# EAGLE design TREM_STM_MOTHERBBOARD (EAGLE 9.2.2)
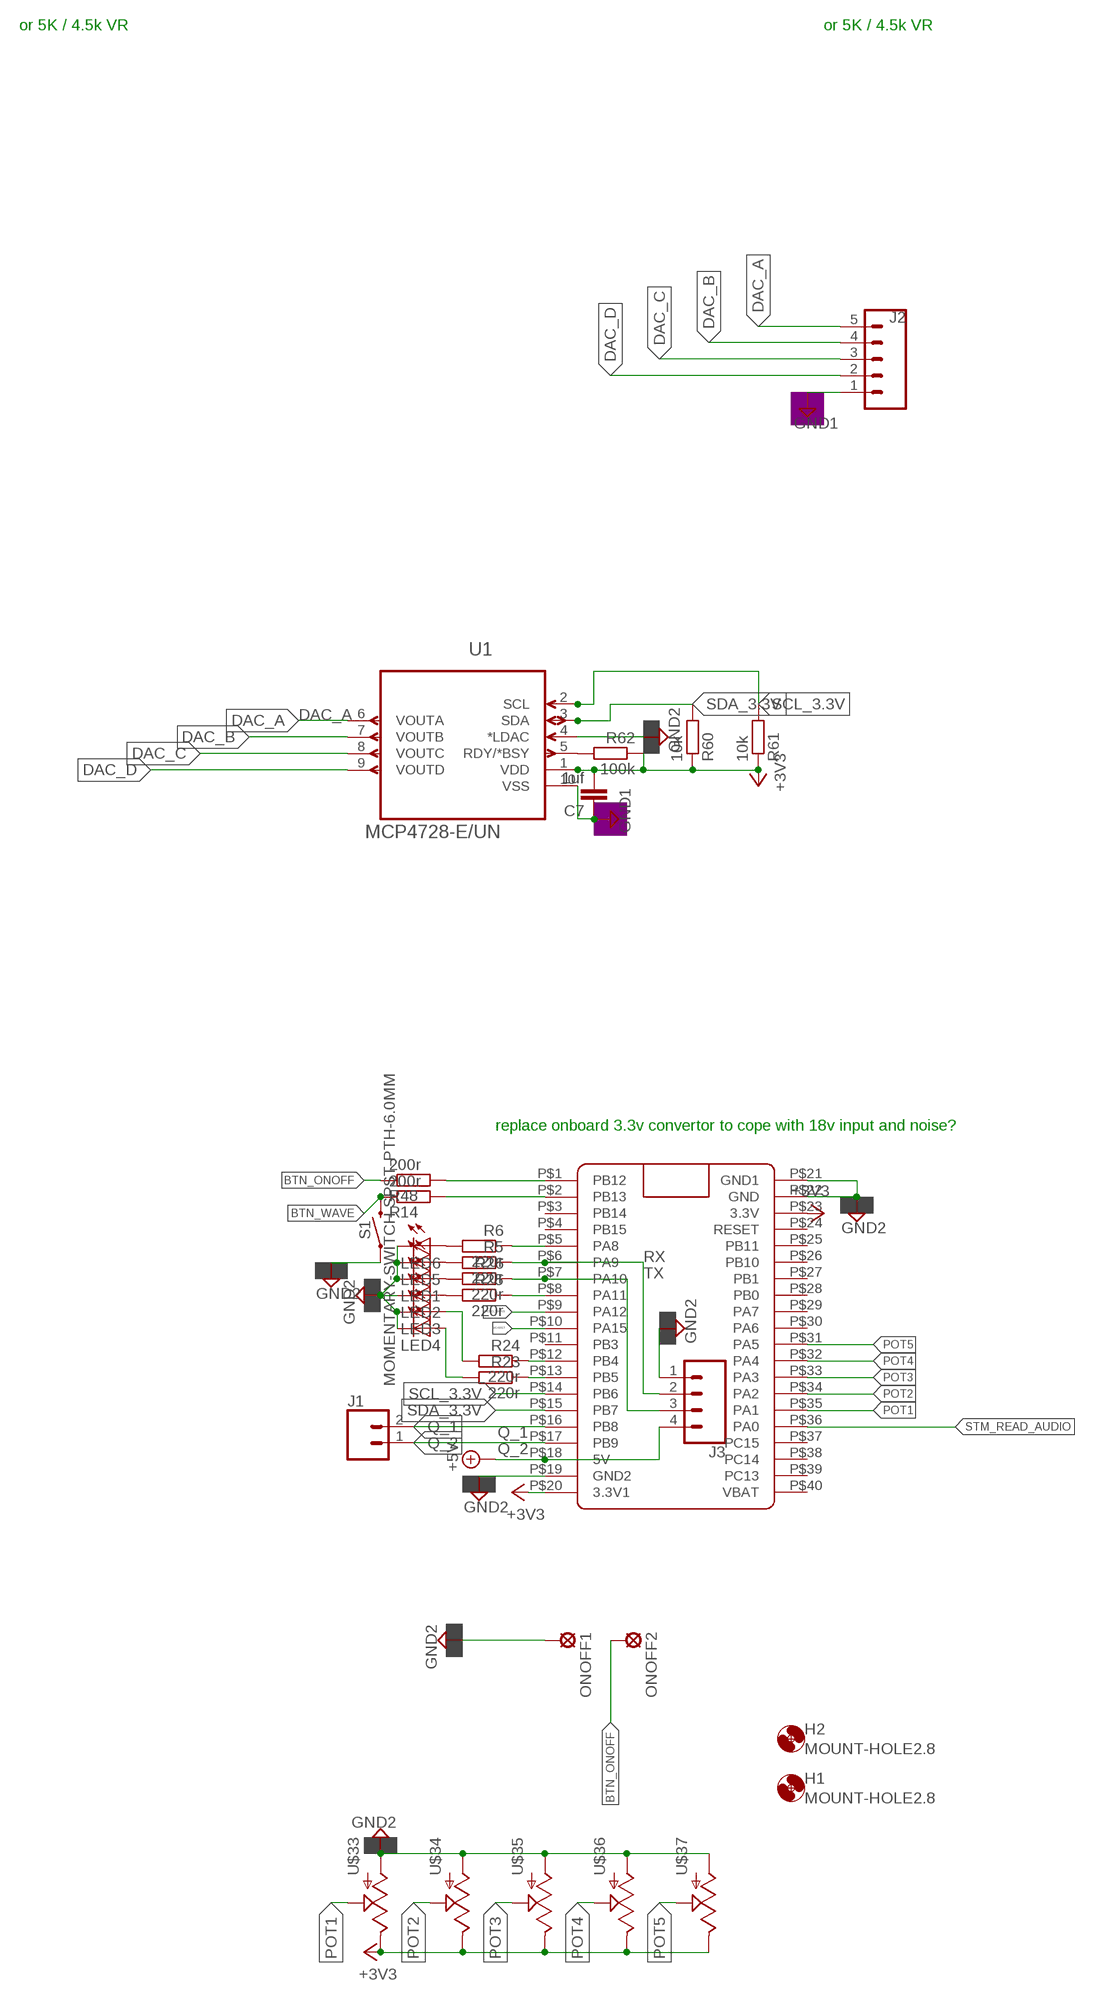
[diagram p0: schematic, sheet 1, part 1 of 2]
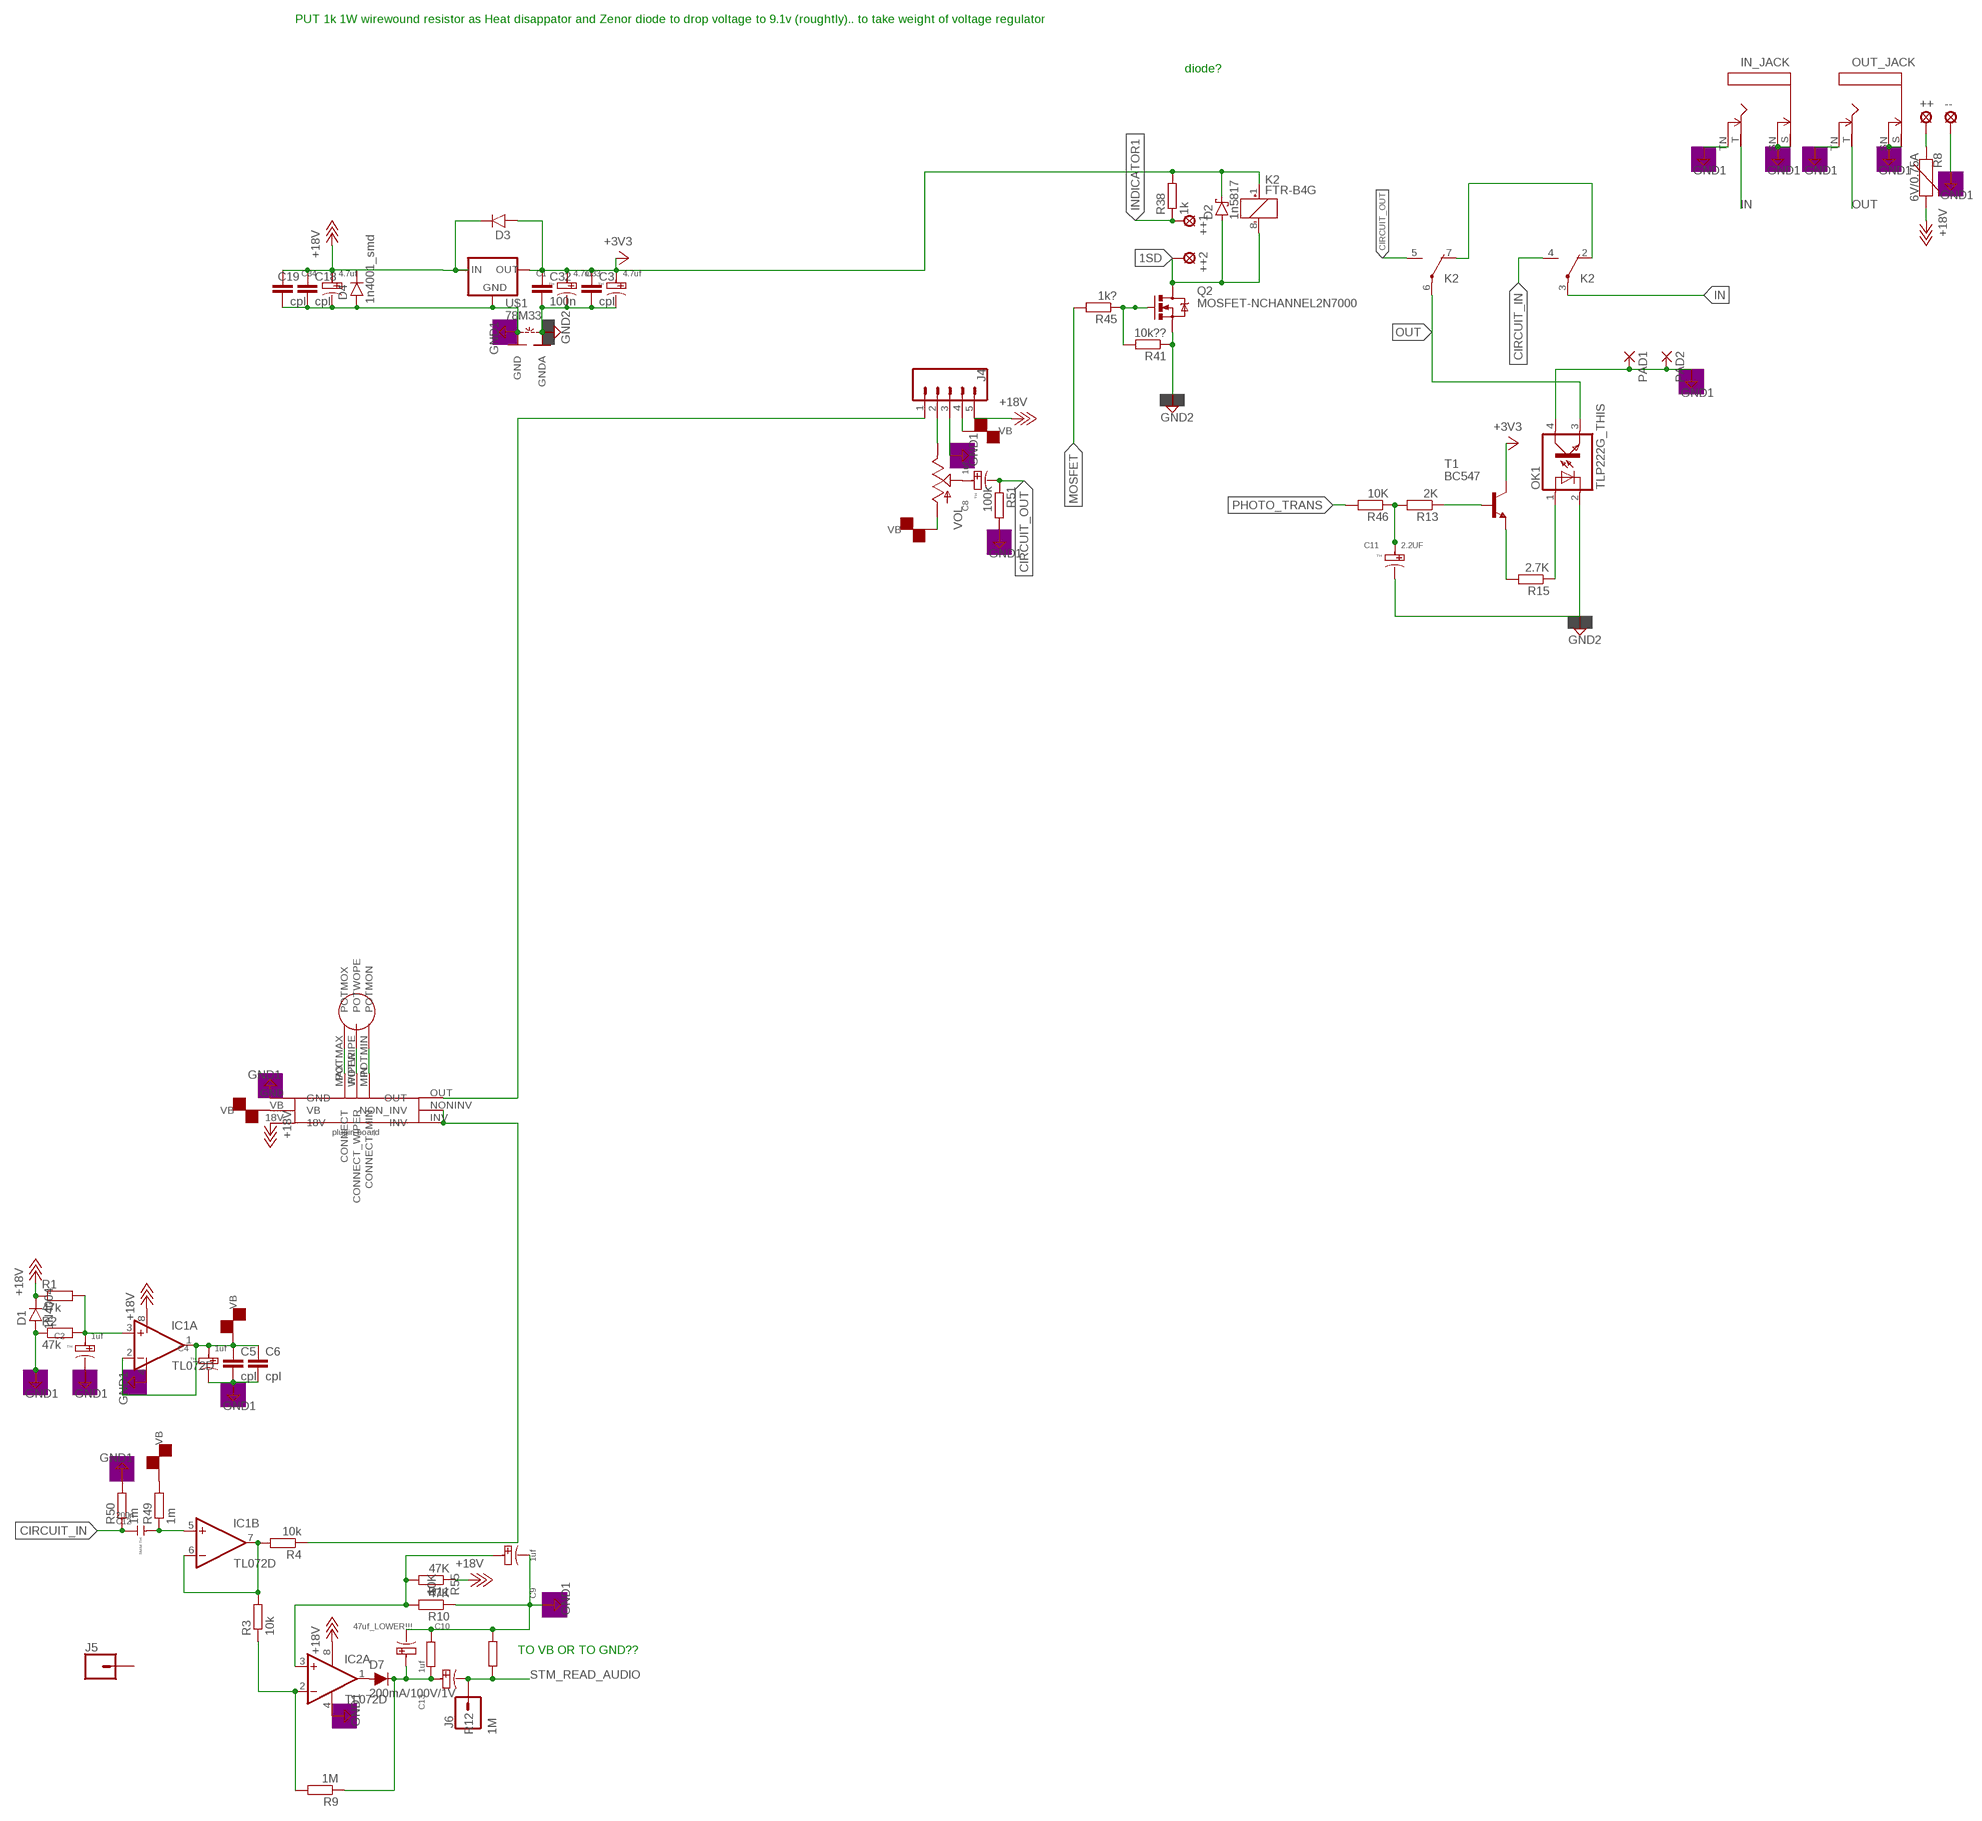
[diagram p1: schematic, sheet 1, part 2 of 2]

## Parts
++  LSP10  [LSP10]
++1  LSP10  [LSP10]
++2  LSP10  [LSP10]
--  LSP10  [LSP10]
C1  4.7uf  THRU-HOLE-POLARIZED  [PC-D5.3MM]
C2  1uf  THRU-HOLE-POLARIZED  [PC-D5.3MM]
C3  cpl  C-EUC1206  [C1206]
C4  1uf  THRU-HOLE-POLARIZED  [PC-D5.3MM]
C5  cpl  C-EUC1206  [C1206]
C6  cpl  C-EUC1206  [C1206]
C7  1uf  C-EUC1206  [C1206]
C8  1uf  THRU-HOLE-POLARIZED  [PC-D5.3MM]
C9  1uf  THRU-HOLE-POLARIZED  [PC-D5.3MM]
C10  47uf_LOWER!!!  THRU-HOLE-POLARIZED  [PC-D5.3MM]
C11  2.2UF  THRU-HOLE-POLARIZED  [PC-D5.3MM]
C12  200n  THRU_HOLE_5MM_SPACING  [CERAMIC-5MM]
C13  1uf  THRU-HOLE-POLARIZED  [PC-D5.3MM]
C18  cpl  C-EUC1206  [C1206]
C19  cpl  C-EUC1206  [C1206]
C32  100n  C-EUC1206  [C1206]
C33  4.7uf  THRU-HOLE-POLARIZED  [PC-D5.3MM]
C34  4.7uf  THRU-HOLE-POLARIZED  [PC-D5.3MM]
D1  1N4004  1N400X.1  [DO41-1]
D2  1n5817  SCHOTTKY-DIODESMD  [SMB]
D3  1n4001_smd  1N400X.1  [DO41-1]
D4  1n4001_smd  1N400X.1  [DO41-1]
D7  200mA/100V/1V  DIODE-1N4148  [DIODE-1N4148]
H1  MOUNT-HOLE2.8  [2,8]
H2  MOUNT-HOLE2.8  [2,8]
IC1  TL072D  [SO08]
IC2  TL072D  [SO08]
IN_JACK  MMMONNNNOHOLES  [MONONOHOLES]
J1  CONN_02PTH3  [1X02_LONGPADS]
J2  CONN_05PTH_LONGPADS  [1X05_LONGPADS]
J3  CONN_04LONGPADS  [1X04_LONGPADS]
J4  CONN_05PTH_LONGPADS  [1X05_LONGPADS]
J5  CONN_01  [1X01]
J6  CONN_01  [1X01]
K2  FTR-B4G  [FTR-B4G]
LED1  LED3MM  [LED3MM]
LED2  LED3MM  [LED3MM]
LED3  LED3MM  [LED3MM]
LED4  LED3MM  [LED3MM]
LED5  LED3MM  [LED3MM]
LED6  LED3MM  [LED3MM]
OK1  TLP222G_THIS  [DIL04]
ONOFF1  LSP10  [LSP10]
ONOFF2  LSP10  [LSP10]
OUT_JACK  MMMONNNNOHOLES  [MONONOHOLES]
PAD1  SMD2  [SMD1,27-2,54]
PAD2  SMD2  [SMD1,27-2,54]
Q2  MOSFET-NCHANNEL2N7000  [TO-92]
R1  47k  R-EU_M1206  [M1206]
R2  47k  R-EU_M1206  [M1206]
R3  10k  R-EU_M1206  [M1206]
R4  10k  R-EU_M1206  [M1206]
R5  220r  R-EU_M1206  [M1206]
R6  220r  R-EU_M1206  [M1206]
R8  6V/0.75A  PPTC_THREE-QUARTER-AMP  [1206]
R9  1M  R-EU_M1206  [M1206]
R10  47K  R-EU_M1206  [M1206]
R11  47K  R-EU_M1206  [M1206]
R12  1M  R-EU_M1206  [M1206]
R13  2K  R-EU_M1206  [M1206]
R14  200r  R-EU_M1206  [M1206]
R15  2.7K  R-EU_M1206  [M1206]
R23  220r  R-EU_M1206  [M1206]
R24  220r  R-EU_M1206  [M1206]
R25  220r  R-EU_M1206  [M1206]
R26  220r  R-EU_M1206  [M1206]
R38  1k  R-EU_M1206  [M1206]
R41  10k??  R-EU_M1206  [M1206]
R45  1k?  R-EU_M1206  [M1206]
R46  10K  R-EU_M1206  [M1206]
R48  200r  R-EU_M1206  [M1206]
R49  1m  R-EU_M1206  [M1206]
R50  1m  R-EU_M1206  [M1206]
R51  100k  R-EU_M1206  [M1206]
R55  10K  R-EU_M1206  [M1206]
R60  10k  R-EU_M1206  [M1206]
R61  10k  R-EU_M1206  [M1206]
R62  100k  R-EU_M1206  [M1206]
S1  MOMENTARY-SWITCH-SPST-PTH-6.0MM  [TACTILE_SWITCH_PTH_6.0MM]
T1  BC547  [TO92]
U1  MCP4728-E/UN  [SOP50P490X110-10N]
U$1  78M33  [SOT223]
U$4  GT_PLUGIN  [PLUGIN_RECIEVE]
U$11  BLUE_PILL  [BLUE_PILL]
U$33  POT  [ALPS_POT]
U$34  POT  [ALPS_POT]
U$35  POT  [ALPS_POT]
U$36  POT  [ALPS_POT]
U$37  POT  [ALPS_POT]
VOL  POT  [ALPS_POT]
~NUDEV~1  GND-GNDA1,27MM  [GND-GNDA-1,27MM]

## Nets
1SD: ++2.MP D2.A K2.8(K:-) Q2.3(D)
+3V3: C1.+ C3.1 C7.2 C32.1 C33.+ D2.C D3.A K2.1(K:+) R38.2 R60.1 R61.1 R62.1 T1.3(C) U1.1(VDD) U$1.3(OUT) U$11.P$20(3.3V1) U$11.P$23(3.3V) U$33.P$1(E) U$34.P$1(E) U$35.P$1(E) U$36.P$1(E) U$37.P$1(E)
+5V: J3.4 U$11.P$18(5V)
+18V: D1.C IC1.8(P:V+) IC2.8(P:V+) J4.5 R1.1 R8.2 R11.1 U$4.18V
BTN_ONOFF: ONOFF2.MP R48.1
BTN_WAVE: R14.1 S1.3
CIRCUIT_IN: C12.1 K2.4(-1:S) R50.1
CIRCUIT_OUT: C8.- K2.5(-2:S) R51.1
DAC_A: J2.5 U1.6(VOUTA)
DAC_B: J2.4 U1.7(VOUTB)
DAC_C: J2.3 U1.8(VOUTC)
DAC_D: J2.2 U1.9(VOUTD)
GND1: --.MP C2.- C4.- C5.2 C6.2 C7.1 C9.- C10.- C18.2 C19.2 C34.- D1.A D4.A IC1.4(P:V-) IC2.4(P:V-) IN_JACK.S IN_JACK.SN IN_JACK.TN J2.1 J4.3 OK1.4(COL) OUT_JACK.S OUT_JACK.SN OUT_JACK.TN PAD1.1(P) PAD2.1(P) R2.1 R10.1 R12.2 R50.2 R51.2 R55.1 U1.10(VSS) U$1.2(GND) U$1.4(GND) U$4.GND ~NUDEV~1.GND
GND2: C1.- C3.2 C11.- C32.2 C33.- J3.1 LED1.K(C) LED2.K(C) LED3.K(C) LED4.K(C) LED5.K(C) LED6.K(C) OK1.2(C) ONOFF1.MP Q2.1(S) R41.1 S1.1 U1.4(*LDAC) U$11.P$19(GND2) U$11.P$21(GND1) U$11.P$22(GND) U$33.P$3(A) U$34.P$3(A) U$35.P$3(A) U$36.P$3(A) U$37.P$3(A) ~NUDEV~1.GNDA
IN: IN_JACK.T K2.3(-1:P)
INDICATOR1: ++1.MP R38.1
MOSFET: R45.2 U$11.P$10(PA15)
N$1: J4.1 U$4.OUT
N$2: C2.+ IC1.3(A:+IN) R1.2 R2.2
N$3: U$4.MAX(CONNECT) U$4.POTMAX(POTMOX)
N$4: U$4.POTWIPE(POTWOPE) U$4.WIPER(CONNECT_WIPER)
N$5: U$4.MIN(CONNECT_MIN) U$4.POTMIN(POTMON)
N$6: R4.1 U$4.INV U$4.NONINV(NON_INV)
N$7: R23.1 U$11.P$13(PB5)
N$8: R24.1 U$11.P$12(PB4)
N$9: C9.+ IC2.3(A:+IN) R10.2 R11.2
N$10: C8.+ VOL.P$2(S)
N$11: C18.1 C19.1 C34.+ D3.C D4.C U$1.1(IN) ; supply symbol labelled +18V
N$12: R62.2 U1.5(RDY/*BSY)
N$13: C10.+ C13.+ D7.C R9.1 R55.2
N$14: IC2.2(A:-IN) R3.1 R9.2
N$15: C11.+ R13.2 R46.1
N$16: IC1.6(B:-IN) IC1.7(B:OUT) R3.2 R4.2
N$17: D7.A IC2.1(A:OUT)
N$18: R15.2 T1.1(E)
N$19: R25.1 U$11.P$8(PA11)
N$20: OK1.1(A) R15.1
N$21: R13.1 T1.2(B)
N$31: LED1.A R26.2
N$36: LED2.A R25.2
N$37: K2.2(-1:O) K2.7(-2:O)
N$38: LED3.A R24.2
N$39: LED4.A R23.2
N$40: J4.2 VOL.P$1(E)
N$41: ++.MP R8.1
N$43: C12.2 IC1.5(B:+IN) R49.1
N$47: R48.2 U$11.P$1(PB12)
N$48: R14.2 U$11.P$2(PB13)
N$50: R6.1 U$11.P$5(PA8)
N$51: LED5.A R5.2
N$52: LED6.A R6.2
N$84: Q2.2(G) R41.2 R45.1
OUT: K2.6(-2:P) OK1.3(EMIT) OUT_JACK.T
PHOTO_TRANS: R46.2 U$11.P$9(PA12)
POT1: U$11.P$35(PA1) U$33.P$2(S)
POT2: U$11.P$34(PA2) U$34.P$2(S)
POT3: U$11.P$33(PA3) U$35.P$2(S)
POT4: U$11.P$32(PA4) U$36.P$2(S)
POT5: U$11.P$31(PA5) U$37.P$2(S)
Q_1: J1.2 U$11.P$16(PB8)
Q_2: J1.1 U$11.P$17(PB9)
RX: J3.2 R5.1 U$11.P$6(PA9)
SCL_3.3V: R61.2 U1.2(SCL) U$11.P$14(PB6)
SDA_3.3V: R60.2 U1.3(SDA) U$11.P$15(PB7)
STM_READ_AUDIO: C13.- J6.1 R12.1 U$11.P$36(PA0)
TX: J3.3 R26.1 U$11.P$7(PA10)
VB: C4.+ C5.1 C6.1 IC1.1(A:OUT) IC1.2(A:-IN) J4.4 R49.2 U$4.VB VOL.P$3(A)
Unconnected: IC2.5(B:+IN) IC2.6(B:-IN) IC2.7(B:OUT) J5.1 U$11.P$3(PB14) U$11.P$4(PB15) U$11.P$11(PB3) U$11.P$24(RESET) U$11.P$25(PB11) U$11.P$26(PB10) U$11.P$27(PB1) U$11.P$28(PB0) U$11.P$29(PA7) U$11.P$30(PA6) U$11.P$37(PC15) U$11.P$38(PC14) U$11.P$39(PC13) U$11.P$40(VBAT)

## Notes on the sheet
- or 5K / 4.5k VR | or 5K / 4.5k VR
- PUT 1k 1W wirewound resistor as Heat disappator and Zenor diode to drop voltage to 9.1v (roughtly).. to take weight of voltage regulator
- diode?
- replace onboard 3.3v convertor to cope with 18v input and noise?
- TO VB OR TO GND??

## Library data of the parts
++ ++1 ++2 -- ONOFF1 ONOFF2 = solpad:LSP10: SOLDER PAD drill 1.0 mm, distributor Buerklin, 12H555
C1 C2 C4 C8-C11 C13 C33 C34 = GT_Capacitor:THRU-HOLE-POLARIZED: 302030033; PACKAGE: TH
C3 C5-C7 C18 C19 C32 = resistor:C-EU: CAPACITOR, European symbol
C12 = GT_Capacitor:THRU_HOLE_5MM_SPACING: 302010202; PACKAGE: 5MM TH
D1 D3 D4 = gm-diodes:1N400X: Rectifier Diodes often used in power supply to prevent damage from reverse polarization
D2 = diode:SCHOTTKY-DIODE: Schottky Diode
D7 = SparkFun-DiscreteSemi:DIODE: Diode These are standard reverse protection diodes and small signal diodes. SparkFun Products: SparkFun SparkPunk Sound Kit <https://www.sparkfun.com/products/11177> SparkFun ESP8266 Thing <https://www.sparkfun.com/products/13231>; PROD_ID: DIO-08378
H1 H2 = holes:MOUNT-HOLE: MOUNTING HOLE with drill center marker
IC1 IC2 = linear:TL072: OP AMP
IN_JACK OUT_JACK = gm-jacks2:MMMONNN
J1 = GT_Connectors:CONN_02: Multi connection point. Often used as Generic Header-pin footprint for 0.1 inch spaced/style header connections On any of the 0.1 inch spaced packages, you can populate with these: Break Away Headers - Straight <https://www.sparkfun.com/products/116> (PRT-00116) Break Away Male Headers - Right Angle <https://www.sparkfun.com/products/553> (PRT-00553) Female Headers <https://www.sparkfun.com/products/115> (PRT-00115) Break Away Headers - Machine Pin <https://www.sparkfun.com/products/117> (PRT-00117) Break Away Female Headers - Swiss Machine Pin <https://www.sparkfun.com/products/743> (PRT-00743) For SCREWTERMINALS and SPRING TERMINALS visit here: Screw Terimnals on SparkFun.com <https://www.sparkfun.com/search/results?term=Screw+Terminals> (5mm/3.5mm/2.54mm spacing) This device is also useful as a general connection point to wire up your design to another part of your project. Our various solder wires solder well into these plated through hole pads. Hook-Up Wire - Assortment (Stranded, 22 AWG) <https://www.sparkfun.com/products/11375> (PRT-11375) Hook-Up Wire - Assortment (Solid Core, 22 AWG) <https://www.sparkfun.com/products/11367> (PRT-11367) View the entire wire category on our website here <https://www.sparkfun.com/categories/141> Special notes: Molex polarized connector foot print use with: PRT-08233 with associated crimp pins and housings. 2.54_SCREWTERM for use with PRT-10571. 3.5mm Screw Terminal footprints for PRT-08084 5mm Screw Terminal footprints for use with PRT-08432
J2 J4 = GT_Connectors:CONN_05: Multi connection point. Often used as Generic Header-pin footprint for 0.1 inch spaced/style header connections On any of the 0.1 inch spaced packages, you can populate with these: Break Away Headers - Straight <https://www.sparkfun.com/products/116> (PRT-00116) Break Away Male Headers - Right Angle <https://www.sparkfun.com/products/553> (PRT-00553) Female Headers <https://www.sparkfun.com/products/115> (PRT-00115) Break Away Headers - Machine Pin <https://www.sparkfun.com/products/117> (PRT-00117) Break Away Female Headers - Swiss Machine Pin <https://www.sparkfun.com/products/743> (PRT-00743) For SCREWTERMINALS and SPRING TERMINALS visit here: Screw Terimnals on SparkFun.com <https://www.sparkfun.com/search/results?term=Screw+Terminals> (5mm/3.5mm/2.54mm spacing) This device is also useful as a general connection point to wire up your design to another part of your project. Our various solder wires solder well into these plated through hole pads. Hook-Up Wire - Assortment (Stranded, 22 AWG) <https://www.sparkfun.com/products/11375> (PRT-11375) Hook-Up Wire - Assortment (Solid Core, 22 AWG) <https://www.sparkfun.com/products/11367> (PRT-11367) View the entire wire category on our website here <https://www.sparkfun.com/categories/141> Special notes: Molex polarized connector foot print use with SKU : PRT-08231 with associated crimp pins and housings. 1MM SMD Version SKU: PRT-10208
J3 = GT_Connectors:CONN_04: Multi connection point. Often used as Generic Header-pin footprint for 0.1 inch spaced/style header connections On any of the 0.1 inch spaced packages, you can populate with these: Break Away Headers - Straight <https://www.sparkfun.com/products/116> (PRT-00116) Break Away Male Headers - Right Angle <https://www.sparkfun.com/products/553> (PRT-00553) Female Headers <https://www.sparkfun.com/products/115> (PRT-00115) Break Away Headers - Machine Pin <https://www.sparkfun.com/products/117> (PRT-00117) Break Away Female Headers - Swiss Machine Pin <https://www.sparkfun.com/products/743> (PRT-00743) For SCREWTERMINALS and SPRING TERMINALS visit here: Screw Terimnals on SparkFun.com <https://www.sparkfun.com/search/results?term=Screw+Terminals> (5mm/3.5mm/2.54mm spacing) This device is also useful as a general connection point to wire up your design to another part of your project. Our various solder wires solder well into these plated through hole pads. Hook-Up Wire - Assortment (Stranded, 22 AWG) <https://www.sparkfun.com/products/11375> (PRT-11375) Hook-Up Wire - Assortment (Solid Core, 22 AWG) <https://www.sparkfun.com/products/11367> (PRT-11367) View the entire wire category on our website here <https://www.sparkfun.com/categories/141> Special notes: Molex polarized connector foot print use with SKU : PRT-08231 with associated crimp pins and housings. 1MM SMD Version SKU: PRT-10208; PROD_ID: CONN-09696
J5 J6 = GT_Connectors:CONN_01: Single connection point. Often used as Generic Header-pin footprint for 0.1 inch spaced/style header connections On any of the 0.1 inch spaced packages, you can populate with these: Break Away Headers - Straight <https://www.sparkfun.com/products/116> (PRT-00116) Break Away Male Headers - Right Angle <https://www.sparkfun.com/products/553> (PRT-00553) Female Headers <https://www.sparkfun.com/products/115> (PRT-00115) Break Away Headers - Machine Pin <https://www.sparkfun.com/products/117> (PRT-00117) Break Away Female Headers - Swiss Machine Pin <https://www.sparkfun.com/products/743> (PRT-00743) This device is also useful as a general connection point to wire up your design to another part of your project. Our various solder wires solder well into these plated through hole pads. Hook-Up Wire - Assortment (Stranded, 22 AWG) <https://www.sparkfun.com/products/11375> (PRT-11375) Hook-Up Wire - Assortment (Solid Core, 22 AWG) <https://www.sparkfun.com/products/11367> (PRT-11367) View the entire wire category on our website here <https://www.sparkfun.com/categories/141> Special notes: SMTSO-256-ET is a "flush mount" nut for a 4-40 screw. We mostly use this on specialty testbeds; it is a nice way to connect hardware to your PCB at an adjustable hieght. Also note, the SNAP packages are for using a snappable style connector. We sell a baggie of snaps and they are also used on two LilyPad designs: Snap Assortment - 30 pack (male and female) <https://www.sparkfun.com/products/11347> (DEV-11347) LilyPad Arduino SimpleSnap <https://www.sparkfun.com/products/10941> (DEV-10941) LilyPad SimpleSnap Protoboard <https://www.sparkfun.com/products/10940> (DEV-10940)
K2 = relay:FTR-B4: ULTRA MINIATURE RELAY 2 POLES - 2 A (Slim Profile Signal Relay) FUJITSU FTR-B4 SERIES Source: FTR-B4.pdf
LED1-LED6 = GOLDTOOTH_LED:LED: LED OSRAM: - CHIPLED LG R971, LG N971, LY N971, LG Q971, LY Q971, LO R971, LY R971 LH N974, LH R974 LS Q976, LO Q976, LY Q976 LO Q996 - Hyper CHIPLED LW Q18S LB Q993, LB Q99A, LB R99A - SideLED LS A670, LO A670, LY A670, LG A670, LP A670 LB A673, LV A673, LT A673, LW A673 LH A674 LY A675 LS A676, LA A676, LO A676, LY A676, LW A676 LS A679, LY A679, LG A679 - Hyper Micro SIDELED® LS Y876, LA Y876, LO Y876, LY Y876 LT Y87S - SmartLED LW L88C, LW L88S LB L89C, LB L89S, LG L890 LS L89K, LO L89K, LY L89K LS L896, LA L896, LO L896, LY L896 - TOPLED LS T670, LO T670, LY T670, LG T670, LP T670 LSG T670, LSP T670, LSY T670, LOP T670, LYG T670 LG T671, LOG T671, LSG T671 LB T673, LV T673, LT T673, LW T673 LH T674 LS T676, LA T676, LO T676, LY T676, LB T676, LH T676, LSB T676, LW T676 LB T67C, LV T67C, LT T67C, LS T67K, LO T67K, LY T67K, LW E67C LS E67B, LA E67B, LO E67B, LY E67B, LB E67C, LV E67C, LT E67C LW T67C LS T679, LY T679, LG T679 LS T770, LO T770, LY T770, LG T770, LP T770 LB T773, LV T773, LT T773, LW T773 LH T774 LS E675, LA E675, LY E675, LS T675 LS T776, LA T776, LO T776, LY T776, LB T776 LHGB T686 LT T68C, LB T68C - Hyper Mini TOPLED® LB M676 - Mini TOPLED Santana® LG M470 LS M47K, LO M47K, LY M47K Source: http://www.osram.convergy.de LUXEON: - LUMILED® LXK2-PW12-R00, LXK2-PW12-S00, LXK2-PW14-U00, LXK2-PW14-V00 LXK2-PM12-R00, LXK2-PM12-S00, LXK2-PM14-U00 LXK2-PE12-Q00, LXK2-PE12-R00, LXK2-PE12-S00, LXK2-PE14-T00, LXK2-PE14-U00 LXK2-PB12-K00, LXK2-PB12-L00, LXK2-PB12-M00, LXK2-PB14-N00, LXK2-PB14-P00, LXK2-PB14-Q00 LXK2-PR12-L00, LXK2-PR12-M00, LXK2-PR14-Q00, LXK2-PR14-R00 LXK2-PD12-Q00, LXK2-PD12-R00, LXK2-PD12-S00 LXK2-PH12-R00, LXK2-PH12-S00 LXK2-PL12-P00, LXK2-PL12-Q00, LXK2-PL12-R00 Source: www.luxeon.com KINGBRIGHT: KA-3528ASYC Source: www.kingbright.com
OK1 = GT_optocoupler:TLP222G_THIS: SIEMENS OPTO COUPLER; OC_FARNELL: unknown; OC_NEWARK: unknown
PAD1 PAD2 = wirepad:SMD2: SMD PAD
Q2 = SparkFun-DiscreteSemi:MOSFET-NCHANNEL: Common NMOSFET Parts MFG P/N Store ID Prod ID FDD8780 TRANS-09984 SI7820DN TRANS-11055 FDS6630A IC-08089 2N7002PW TRANS-11151 FQP30N06L COM-10213 TRANS-10060 BSS123LT1G TRANS-08345 BSS138 TRANS-00830 BS170 2N7000
R1-R6 R9-R15 R23-R26 R38 R41 R45 R46 R48-R51 R55 R60-R62 = resistor:R-EU_: RESISTOR, European symbol
R8 = GOLDTOOTH-Fuses:PPTC: Resettable Fuse PPTC Resettable Fuse. Really a sort of resistor with a polymeric positive temperature coefficient whose resistance increases dramatically with an increase in temperature. When heated by the power passing through the resistance rises causing the current to be limited, protecting the circuit. This is achieved by the transition of the polymer from a crystalline to an amorphous state where the conductive carbon separates breaking the conductive pathways found in the cool crystalline structure. When a PPTC cools back down it resumes conducting letting the circuit turn back on. SparkFun Products: SparkFun RedBoard - Programmed with Arduino <https://www.sparkfun.com/products/12757> Pro Micro - 5V/16MHz <https://www.sparkfun.com/products/12640> Arduino Pro 328 - 5V/16MHz <https://www.sparkfun.com/products/10915> MP3 Trigger <https://www.sparkfun.com/products/13720>; PROD_ID: RES-11150
S1 = SparkFun-Switches:MOMENTARY-SWITCH-SPST: Momentary Switch (Pushbutton) - SPST Normally-open (NO) SPST momentary switches (buttons, pushbuttons). Variants PTH-12MM - 12mm square, through-hole Momentary Pushbutton Switch - 12mm Square <https://www.sparkfun.com/products/9190> (COM-09190) PTH-6.0MM, PTH-6.0MM-KIT - 6.0mm square, through-hole Mini Pushbutton Switch <https://www.sparkfun.com/products/97> (COM-00097) KIT package intended for soldering kit's - only one side of pads' copper is exposed. PTH-RIGHT-ANGLE-KIT - Right-angle, through-hole Right Angle Tactile Button <https://www.sparkfun.com/products/10791> - Used on SparkFun BigTime Watch Kit <https://www.sparkfun.com/products/11734> SMD-12MM - 12mm square, surface-mount Tactile Button - SMD (12mm) <https://www.sparkfun.com/products/12993> (COM-12993) Used on SparkFun PicoBoard <https://www.sparkfun.com/products/11888> SMD-4.5MM - 4.5mm Square Trackball Switch Used on SparkFun Blackberry Trackballer Breakout <https://www.sparkfun.com/products/13169> SMD-4.6MMX2.8MM - 4.60mm x 2.80mm, surface mount Used on SparkFun SAMD21 Mini Breakout <https://www.sparkfun.com/products/13664> SMD-5.2MM, SMD-5.2-REDUNDANT - 5.2mm square, surface-mount Mini Pushbutton Switch - SMD <https://www.sparkfun.com/products/8720> (COM-08720) Used on Arduino Pro Mini <https://www.sparkfun.com/products/11114> REDUNDANT package connects both switch circuits together SMD-6.0X3.5MM - 6.0 x 3.5mm, surface mount Momentary Reset Switch SMD <https://www.sparkfun.com/products/8229> (COM-08229) SMD-6.2MM-TALL - 6.2mm square, surface mount Tactile Button - SMD (6mm) <https://www.sparkfun.com/products/12992> Used on SparkFun Digital Sandbox <https://www.sparkfun.com/products/12651> SMD-RIGHT-ANGLE - Right-angle, surface mount Used on SparkFun Block for Intel® Edison - Arduino <https://www.sparkfun.com/products/13036>; PROD_ID: SWCH-08441; SF_SKU: COM-00097
T1 = transistor:BC547: NPN TRANSISTOR
U1 = GD_MCP4728:MCP4728-E/UN: IC, DAC, 12BIT, QUAD; MPN: MCP4728-E/UN; OC_FARNELL: 1800217; OC_NEWARK: 08R1808; PACKAGE: MSOP-10; SUPPLIER: MICROCHIP
U$1 = v-reg-2:78M33
U$4 = BluePill:GT_PLUGIN
U$11 = BluePill:BLUE_PILL
U$33-U$37 VOL = SparkFun-Electromechanical:POT
~NUDEV~1 = ground-junctions:GND-GNDA: Connect GND - GNDA without DRC-Error, display layer 53 (54) to make copper (ROUTE) from GND to GNDA Select also layer 53 (54) in CAM-Job!

## Board
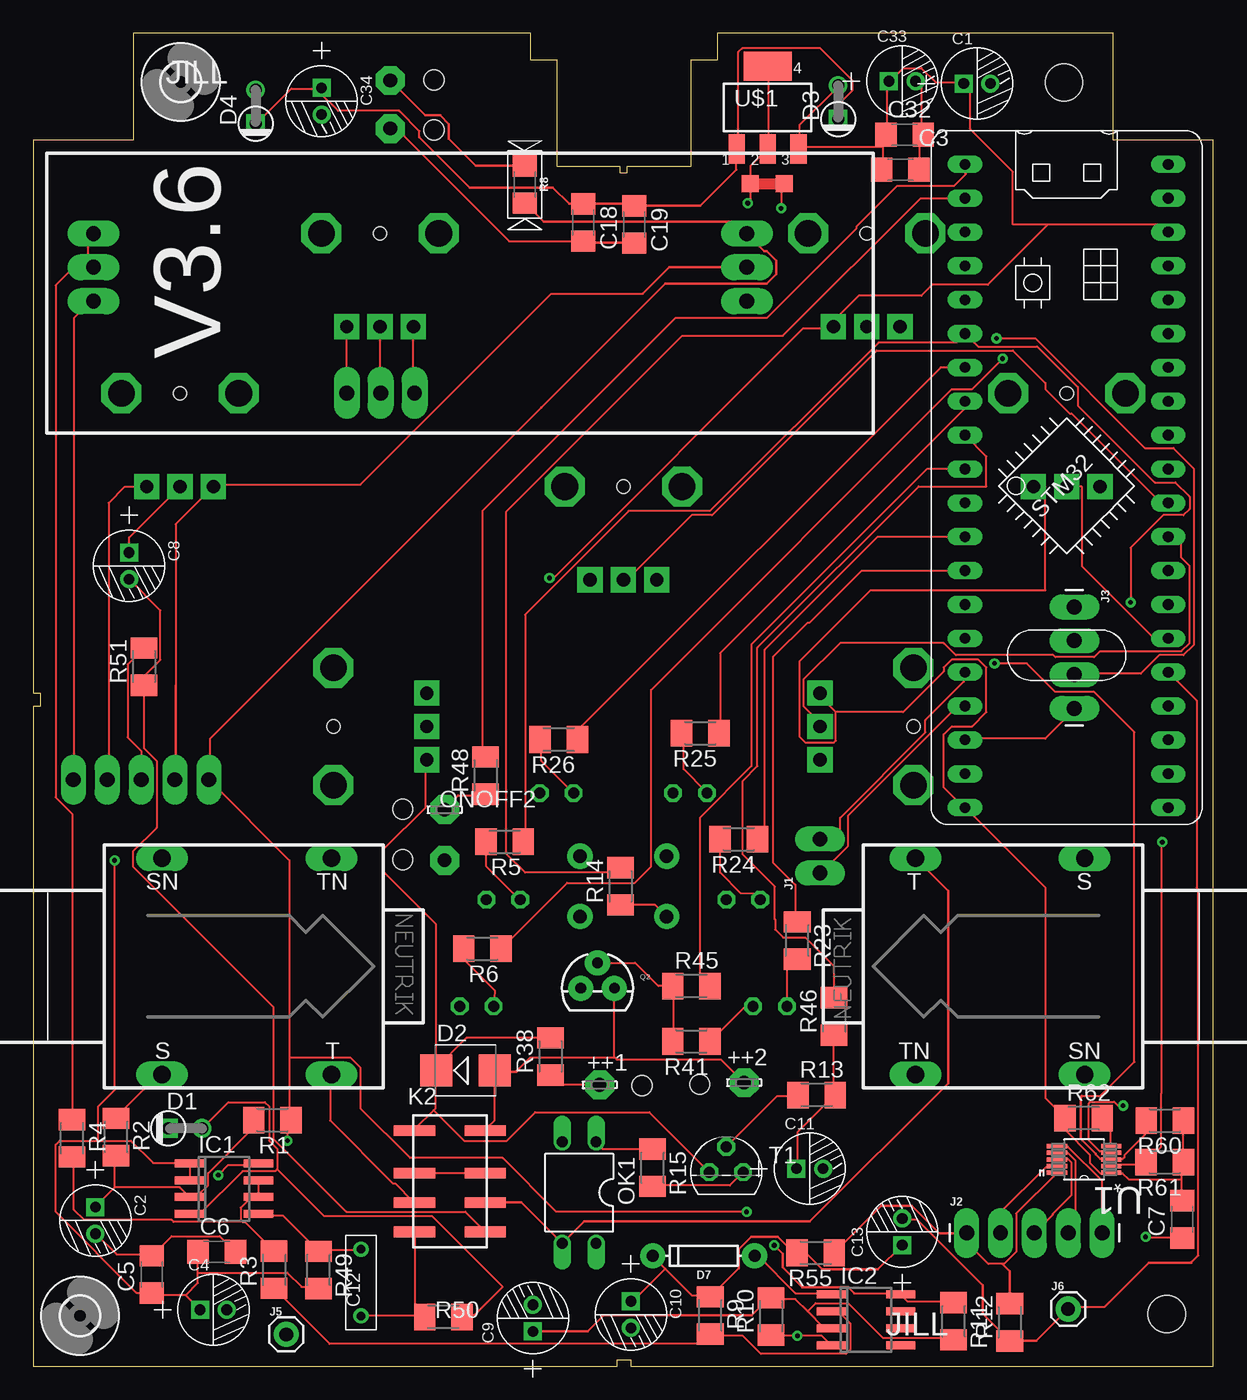
[diagram p2: board, top side]
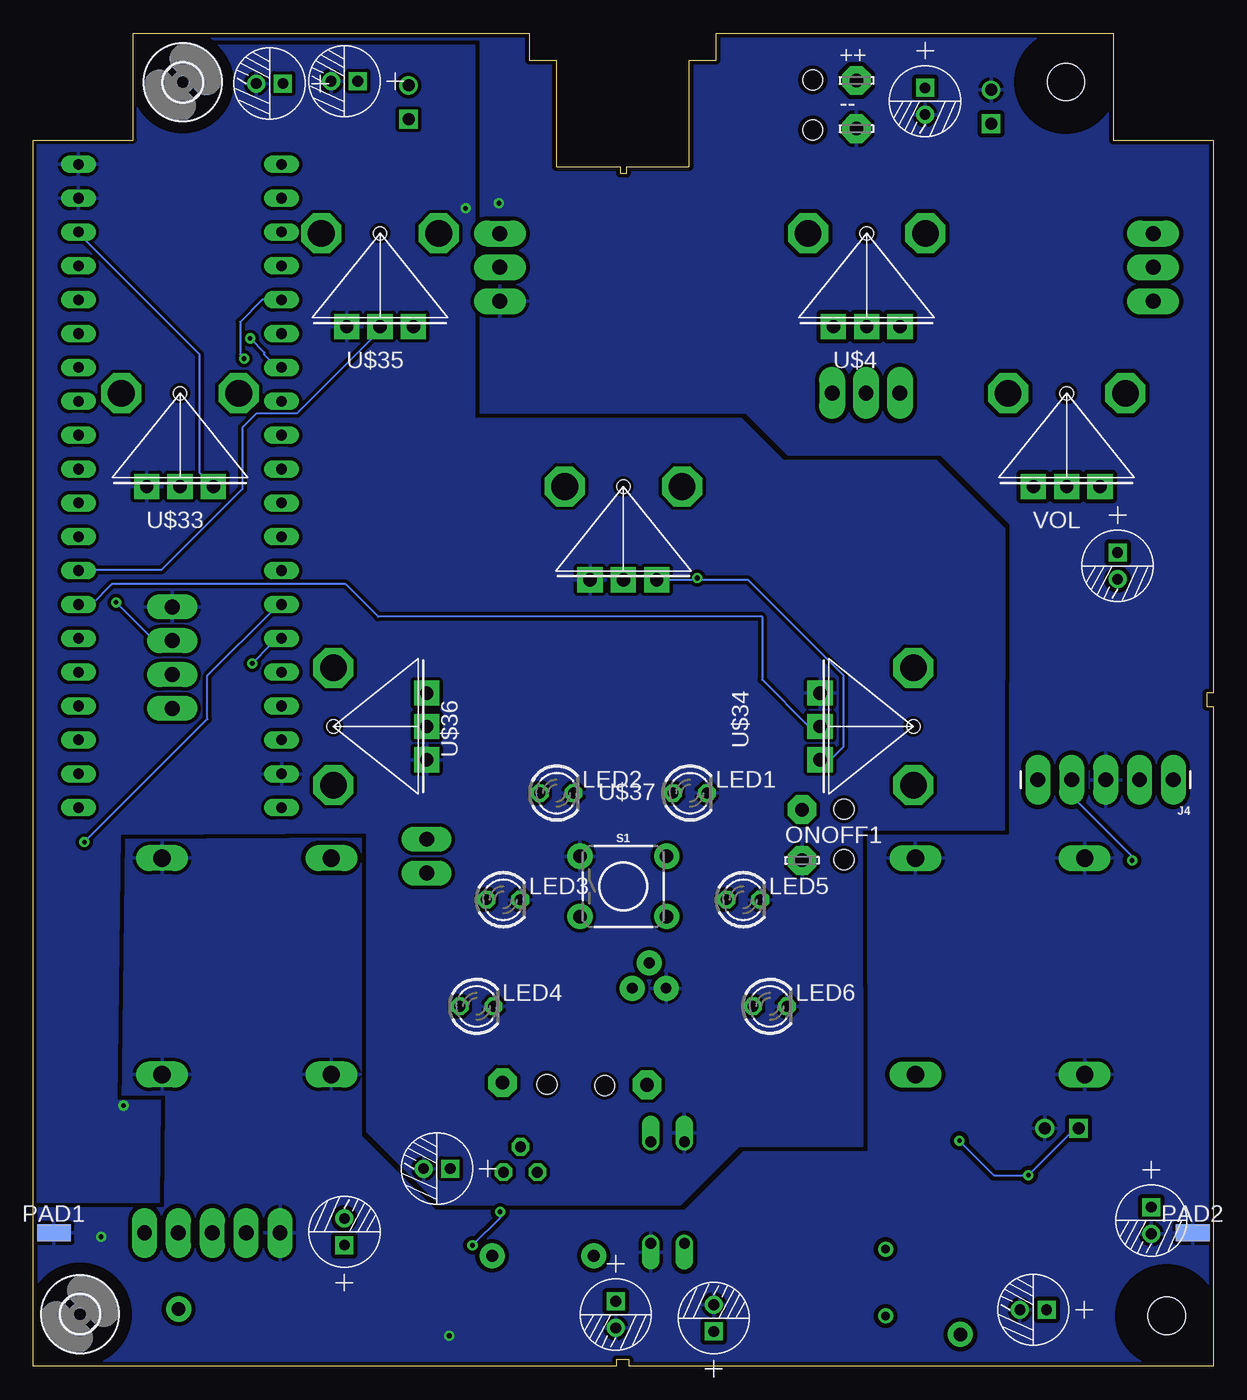
[diagram p3: board, bottom side, seen from below]

Size 88.5 x 100 mm. Coordinates in mm from the lower left corner, seen from the top.
Outline: 88.5,92 81,92 81,100 51.3,100 51.3,98 49.3,98 49.3,90 44.5,90 44.5,89.5 44,89.5 44,90 39.3,90 39.3,98 37.3,98 37.3,100 7.5,100 7.5,92 0,92 0,50.5 0.5,50.5 0.5,49.5 0,49.5 0,0 43.8,0 43.8,0.5 44.8,0.5 44.8,0 88.5,0 88.5,92
Copper layers (1*16): Top 0.035mm / dielectric 1.5mm / Bottom 0.035mm
Design rules "default *": minimum track width 6mil, minimum drill 0.35mm, track to track 6mil, track to pad 6mil, pad to pad 6mil, via to via 6mil, smd to smd 6mil, copper to edge 10mil, drill to drill 6mil, minimum pad ring 10mil, minimum via ring 8mil, stop-mask expansion 4mil, vias tented up to drill 0mil, thermal gap 10mil

### Footprints (pad centres in the part's own frame; a part is rotated, then mirrored left to right if it is on the bottom)
LSP10 = drill 1.016 pad 2.159 octagon: MP 0,0
PC-D5.3MM = drill 0.8 pad 1.35 square: + -1,0 | drill 0.8 pad 1.35: - 1,0
C1206 = smd 1.6 x 1.8: 1 -1.4,0; 2 1.4,0
CERAMIC-5MM = drill 0.635 pad 1.143: 1 -2.5,0; 2 2.5,0
DO41-1 = drill 0.9: A 1.27,0 | drill 0.9 square: C -1.27,0
SMB = smd 2.4 x 2.4: A 2.2,0; C -2.2,0
DIODE-1N4148 = drill 0.9 pad 1.88: A -3.81,0; C 3.81,0
2,8 = hole 2.8: 0,0
SO08 = smd 0.6 x 2.2: 1 -1.905,-2.6; 2 -0.635,-2.6; 3 0.635,-2.6; 4 1.905,-2.6; 5 1.905,2.6; 6 0.635,2.6; 7 -0.635,2.6; 8 -1.905,2.6
MONONOHOLES = drill 1.3 long: S 6.35,8.115; SN 6.35,-8.115; T -6.35,8.115; TN -6.35,-8.115
1X02_LONGPADS = drill 1.118 pad 1.88 long: 1 0,0; 2 2.54,0
1X05_LONGPADS = drill 1.118 pad 1.88 long: 1 0,0; 2 2.54,0; 3 5.08,0; 4 7.62,0; 5 10.16,0
1X04_LONGPADS = drill 1.118 pad 1.88 long: 1 0,0; 2 2.54,0; 3 5.08,0; 4 7.62,0
1X01 = drill 1.016 pad 1.88: 1 0,0
FTR-B4G = smd 0.8 x 3.1: 1 -3.8,-2.65; 2 -0.6,-2.65; 3 1.6,-2.65; 4 3.8,-2.65; 5 3.8,2.65; 6 1.6,2.65; 7 -0.6,2.65; 8 -3.8,2.65
LED3MM = drill 0.813 octagon: A -1.27,0; K 1.27,0
DIL04 = drill 0.813 offset: 1 -1.27,-3.81; 2 1.27,-3.81; 3 1.27,3.81; 4 -1.27,3.81
SMD1,27-2,54 = smd 1.27 x 2.54: 1 0,0
TO-92 = drill 0.813 pad 1.88: 1 -1.27,0; 2 0,1.905; 3 1.27,0
M1206 = smd 1.6 x 2: 1 -1.4,0; 2 1.4,0
1206 = smd 1.6 x 1.8: 1 -1.4,0; 2 1.4,0
TACTILE_SWITCH_PTH_6.0MM = drill 1.016 pad 1.88: 1 -3.251,2.261; 2 3.251,2.261; 3 -3.251,-2.261; 4 3.251,-2.261
TO92 = drill 0.813 octagon: 1 1.27,0; 2 0,1.905; 3 -1.27,0
SOP50P490X110-10N = smd 1.524 x 0.33: 1 -2.032,0.991; 2 -2.032,0.508; 3 -2.032,0; 4 -2.032,-0.508; 5 -2.032,-0.991; 6 2.032,-0.991; 7 2.032,-0.508; 8 2.032,0; 9 2.032,0.508; 10 2.032,0.991
SOT223 = smd 1.219 x 2.235: 1 -2.311,-3.099; 2 0,-3.099; 3 2.311,-3.099 | smd 3.6 x 2.2: 4 0,3.099
HOLD = hole 1.5: 0,0
PLUGIN_RECIEVE = drill 1.118 pad 1.956 long: 18V -27.511,0.017; GND -27.511,5.097; INV 21.489,0.017; MAX -2.591,11.989; MIN 2.489,11.989; NONINV 21.489,2.557; OUT 21.489,5.097; VB -27.511,2.557; WIPER -0.051,11.989 | drill 2 octagon: P$4 4.4,0; P$5 -4.4,0 | drill 1 pad 1.88 square: POTMAX -2.5,7; POTMIN 2.5,7; POTWIPE 0,7 | hole 1: 0,0
BLUE_PILL = drill 0.8 long: P$1 -7.62,15.24; P$2 -7.62,12.7; P$3 -7.62,10.16; P$4 -7.62,7.62; P$5 -7.62,5.08; P$6 -7.62,2.54; P$7 -7.62,0; P$8 -7.62,-2.54; P$9 -7.62,-5.08; P$10 -7.62,-7.62; P$11 -7.62,-10.16; P$12 -7.62,-12.7; P$13 -7.62,-15.24; P$14 -7.62,-17.78; P$15 -7.62,-20.32; P$16 -7.62,-22.86; P$17 -7.62,-25.4; P$18 -7.62,-27.94; P$19 -7.62,-30.48; P$20 -7.62,-33.02; P$21 7.62,15.24; P$22 7.62,12.7; P$23 7.62,10.16; P$24 7.62,7.62; P$25 7.62,5.08; P$26 7.62,2.54; P$27 7.62,0; P$28 7.62,-2.54; P$29 7.62,-5.08; P$30 7.62,-7.62; P$31 7.62,-10.16; P$32 7.62,-12.7; P$33 7.62,-15.24; P$34 7.62,-17.78; P$35 7.62,-20.32; P$36 7.62,-22.86; P$37 7.62,-25.4; P$38 7.62,-27.94; P$39 7.62,-30.48; P$40 7.62,-33.02
ALPS_POT = drill 1 pad 1.88 square: P$1 7,-2.5; P$2 7,0; P$3 7,2.5 | drill 2 octagon: P$4 0,-4.4; P$5 0,4.4 | hole 1: 0,0
GND-GNDA-1,27MM = smd 1.27 x 1.27: GND -1.27,0; GNDA 1.27,0

### Placement (x,y rotation side)
++  26.77,96.47 0 bottom
++1  42.47,21.11 0 top
++2  53.31,21.27 0 top
--  26.77,92.85 0 bottom
C1  70.78,96.23 0 top
C2  4.66,10.93 270 top
C3  65.03,89.75 0 top
C4  13.5,4.23 0 top
C5  8.88,6.88 90 top
C6  13.76,8.57 0 top
C7  86.16,11.02 90 top
C8  7.18,60.05 270 top
C9  37.47,3.61 90 top
C10  44.81,3.87 270 top
C11  58.23,14.82 0 top
C12  24.57,6.28 90 top
C13  65.17,10.08 90 top
C18  41.26,85.8 270 top
C19  45.07,85.66 270 top
C32  65.34,92.38 0 top
C33  65.16,96.41 0 top
C34  21.62,94.9 270 top
D1  11.38,17.84 0 top
D2  32.41,22.19 0 top
D3  60.36,94.82 90 top
D4  16.67,94.48 90 top
D7  50.28,8.28 180 top
H1  85,3.91 0 bottom
H2  3.5,3.78 0 top
H3  MOUNT-HOLE2.8  [2,8]  11.05,96.35 0 top
H4  MOUNT-HOLE2.8  [2,8]  77.3,96.32 0 bottom
IC1  14.29,13.32 270 top
IC2  62.45,3.48 270 top
IN_JACK  16,30 180 top
J1  59,37 90 top
J2  70,10 0 top
J3  78.08,56.97 270 top
J4  3,44 180 bottom
J5  18.97,2.38 0 top
J6  77.61,4.29 0 top
K2  31.24,13.89 270 top
LED1  39.25,43 0 bottom
LED2  49.25,43 0 bottom
LED3  53.25,35 0 bottom
LED4  55.25,27 0 bottom
LED5  35.25,35 0 bottom
LED6  33.25,27 0 bottom
OK1  40.94,13.03 180 top
ONOFF1  30.85,37.95 0 bottom
ONOFF2  30.85,41.76 0 top
OUT_JACK  72.5,30 0 top
PAD1  86.95,10 270 bottom
PAD2  1.53,10 270 bottom
Q2  42.31,28.36 0 top
R1  17.93,18.47 180 top
R2  6.21,17.2 270 top
R3  18.06,7.24 90 top
R4  2.91,17.11 270 top
R5  35.35,39.35 180 top
R6  33.68,31.32 180 top
R8  36.86,88.66 270 top
R9  50.77,3.8 270 top
R10  55.33,3.73 90 top
R11  69.02,3.38 270 top
R12  73.23,3.3 90 top
R13  58.74,20.35 0 top
R14  44.03,36 90 top
R15  46.45,14.89 270 top
R23  57.29,31.94 270 top
R24  52.91,39.53 180 top
R25  50.02,47.49 180 top
R26  39.4,47.02 180 top
R38  38.79,23.23 90 top
R41  49.36,24.36 180 top
R45  49.36,28.52 0 top
R46  60.06,26.24 90 top
R48  33.92,44.3 90 top
R49  21.39,7.22 270 top
R50  30.76,3.69 0 top
R51  8.29,52.48 90 top
R55  58.67,8.51 180 top
R60  84.87,18.44 180 top
R61  84.85,15.31 180 top
R62  78.77,18.6 0 top
S1  44.25,36 0 bottom
T1  51.97,14.55 0 top
U1  78.81,15.51 180 top
U$1  55.07,94.43 0 top
U$2  [HOLD]  27.7,41.78 0 top
U$3  [HOLD]  27.7,38 0 top
U$4  26,85 180 top
U$5  [HOLD]  30.05,96.5 0 top
U$9  [HOLD]  30.05,92.74 0 top
U$11  77.5,74.93 0 top
U$12  [HOLD]  45.64,21.04 0 top
U$13  [HOLD]  49.98,21.14 0 top
U$33  77.5,73 270 top
U$34  22.5,48 0 top
U$35  62.5,85 270 top
U$36  66,48 180 top
U$37  44.25,66 270 top
VOL  11,73 270 top
~NUDEV~1  55.04,88.71 0 top

### Tracks (layer width: path | path; a pad name or v marks a point on that pad's centre or on a via)
1SD
  Top 0.152: D2.A 34.59,22.1 34.59,18.44 33.98,17.83 K2.8 | 36.31,22.19 37.28,23.16 43.58,23.16 | 53.14,21.27 ++2.MP 51.57,23.01 43.74,23.01 43.59,23.16 43.58,23.16 | 43.58,23.16 Q2.3
  Top 0.203: 36.31,22.19 36.22,22.1 34.59,22.1
+3V3  (via drill 0.35)
  Top 0.152: U$33.P$1 75.89,65.99 75.89,58.22 62.79,58.22 57.45,52.88 57.45,47.24 57.91,46.79 60.05,46.79 60.2,46.94 60.2,49.07 | 76.1,85.65 71.59,81.14 67.42,81.14 66.6,80.31 61.9,80.31 60,78.42 U$35.P$1 60.35,77.88 57.76,77.88 39.01,59.13 v38.71,59.13 | 30.02,19.2 28.65,17.83 K2.1 | 30.02,19.2 30.18,19.36 30.18,22.1 D2.C 30.18,22.25 30.18,22.32 | 30.18,22.32 30.18,33.19 26.3,37.07 26.3,38.79 29.41,41.91 29.41,45.41 U$34.P$1 | 86.11,14.02 86.11,15.24 R61.1 86.26,15.39 86.26,18.29 R60.1 | 86.11,14.02 86.11,12.42 C7.2 | 86.11,14.02 82.14,14.02 81.69,14.48 80.92,14.48 U1.1 80.77,14.48 80.01,14.48 79.25,15.24 79.25,15.85 77.42,17.68 77.42,18.59 R62.1 77.37,18.64 75.92,20.1 75.92,35.88 U$11.P$20 | 57.45,91.44 57.45,93.12 60.35,96.01 D3.A | 63.7,91.44 63.7,92.2 63.86,92.35 C32.1 64.01,92.51 64.01,96.16 64.16,96.32 C33.+ 64.31,96.47 65.23,97.38 66.6,97.38 67.67,96.32 69.77,96.32 C1.+ 70.26,96.21 70.26,92.81 73.46,89.61 73.46,85.65 76.1,85.65 | 63.7,91.44 63.7,89.76 C3.1 | 63.7,91.44 57.45,91.44 | 57.45,91.44 U$1.3 | R38.2 32.48,24.63 30.18,22.32 | 60.2,49.07 59.13,50.14 59.13,50.44 U$36.P$1 | 60.2,49.07 65.23,49.07 68.28,52.12 68.28,52.43 68.89,53.03 70.87,53.03 71.48,52.43 71.48,49.07 70.41,48.01 68.89,48.01 68.28,47.4 68.28,43.43 69.8,41.91 | U$11.P$23 84.56,85.65 76.1,85.65 | 30.02,19.2 32.31,16.92 35.51,16.92 37.64,19.05 46.2,19.05 T1.3
  Top 0.203: U$11.P$20 69.8,41.91
  Bottom 0.152: 38.71,58.98 34.9,58.98 27.74,51.82 27.74,46.48 28.65,45.57 29.41,45.57 U$34.P$1 | 38.71,58.98 41.6,58.98 U$37.P$1 | 38.71,58.98 v38.71,59.13 | U$11.P$23 85.12,85 76.05,75.93 76.05,67.05 U$33.P$1
+5V
  Top 0.152: U$11.P$18 69.95,47.09 75.89,47.09 78.03,49.23 J3.4
+18V  (via drill 0.35)
  Top 0.152: v13.87,14.33 14.63,15.09 16.76,15.09 IC1.8 | 19.2,23.16 19.2,37.95 13.26,43.89 J4.5 13.26,44.1 13.26,47.09 38.1,71.93 | 19.2,23.16 19.2,18.59 R1.1 19.2,18.44 19.05,18.29 v19.05,16.92 | 36.85,87.27 R8.2 | 19.2,23.16 23.77,23.16 24.54,22.4 24.54,19.36 28.27,15.63 35.19,15.63 39.23,11.58 v53.49,11.58 | 69.02,5.03 R11.1 68.89,4.88 65.53,4.88 65.08,5.33 IC2.8 64.95,5.49 61.57,5.49 | v53.49,11.58
  Top 0.203: 38.1,71.93 47.38,81.21 55,81.21 55.72,81.93 55.72,82.95 55,83.67 54.82,83.67 U$4.18V 52.63,85.86 38.27,85.86 R8.2 | v55.56,9.07 56.22,8.42 56.22,7.4 57.69,5.94 61.12,5.94 61.57,5.49
  Bottom 0.152: D1.C 10.21,17.98 v13.87,14.33 16.46,14.33 v19.05,16.92 | v55.56,9.07 53.49,11.15 v53.49,11.58
BTN_ONOFF
  Top 0.152: R48.1 33.83,42.82 31.85,42.82 30.94,41.91 ONOFF2.MP
BTN_WAVE
  Top 0.152: R14.1 44.04,34.59 46.63,34.59 47.4,33.83 S1.3
CIRCUIT_IN
  Top 0.152: 28.65,3.81 24.69,3.81 C12.1 | 28.65,3.81 29.26,3.81 R50.1 28.65,3.81 | 28.65,3.81 28.65,10.06 K2.4
CIRCUIT_OUT
  Top 0.152: C8.- 9.52,56.7 9.52,52.98 8.29,51.75 R51.1 8.29,46.38 9.25,45.42 9.25,40.39 7.47,38.61 7.47,37.49 17.98,26.98 17.98,17.07 23.47,11.58 32.4,11.58 K2.5
DAC_A
  Top 0.152: U1.6 76.82,16.46 77.6,16.46 80.16,13.9 J2.5
DAC_B
  Top 0.152: J2.4 77.62,10.85 78.18,11.41 78.18,15.39 77.57,16 76.8,16 U1.7
DAC_C
  Top 0.152: U1.8 76.81,15.54 77.57,15.54 77.88,15.24 77.88,12.85 76.45,11.42 76.45,11.37 J2.3
DAC_D
  Top 0.152: J2.2 72.5,10.04 72.5,11.49 75.94,14.94 76.71,14.94 U1.9
GND1  (via drill 0.35)
  Top 0.152: R50.2 32.31,3.81 33.07,3.81 35.2,5.94 29.87,11.28 21.79,11.28 18.29,14.78 | 41.3,84.28 C18.2 35.69,84.4 27.24,92.85 --.MP | 44.96,84.28 C19.2 45.09,84.28 | C2.- 4.72,9.91 6.25,8.38 8.84,8.38 C5.2 10.36,9.75 13.97,9.75 C6.2 | R2.1 6.25,18.75 9.45,21.95 IN_JACK.S | 18.29,14.78 18.14,14.63 15.7,14.63 12.5,11.43 11.73,11.43 IC1.4 | 18.29,14.78 18.29,16.31 17.68,16.92 17.68,19.51 17.37,19.81 14.63,19.81 12.8,17.98 D1.A | C7.1 83.51,9.62 v83.42,9.7 | J2.1 70,9.96 70,9.3 71.63,7.67 72.67,7.67 72.8,7.67 73.71,8.58 73.71,11.45 U1.10 | 55.17,91.44 55.17,97.38 U$1.4 | ~NUDEV~1.GND 53.77,87.44 v53.59,87.26 | U$1.2 53.77,90.03 ~NUDEV~1.GND | ~NUDEV~1.GND 53.77,88.67 | J4.3 8.08,46.16 7.07,47.17 7.07,52.65 R51.2 | R10.1 55.47,2.29 v57.3,2.29 59.13,2.29 59.74,1.68 IC2.4
  Top 0.203: U$1.2 55.17,91.43 55.17,91.44 | C18.2 41.39,84.28 44.96,84.28 | R12.2 73.23,7.11 72.67,7.67 | 70,9.96 67.95,9.96 65.89,12.01 63.58,12.01 R55.1
  pour Bottom (isolate 0.31, rank 6): -0.17,99.87 88.73,99.87 88.73,-0.46 -0.17,-0.46
GND2  (via drill 0.35)
  Top 0.152: C3.2 66.45,89.76 66.45,92.2 66.6,92.35 C32.2 66.6,92.51 66.6,96.01 66.29,96.32 C33.- | ~NUDEV~1.GNDA 56.08,88.49 v56.08,86.87 | LED4.K 53.4,27 R41.1 | U1.4 80.75,16.11 79.99,16.11 79.14,16.95 79.14,19.7 79.28,19.83 81.07,19.83 81.35,19.55 v81.73,19.55
  pour Bottom (isolate 0.254): 88.9,96.52 88.9,12.33 79.07,12.33 78.96,19.91 82.25,19.91 82,39.92 63.48,40.03 63.48,17.61 58.04,12.16 39.94,12.16 35.55,16.55 26.31,16.52 26.32,40.26 15.7,40.26 15.65,62.8 20.75,67.9 32.21,67.9 35.36,71.05 55.38,71.05 55.38,99.06 86.36,99.06
IN
  Top 0.152: K2.3 28.5,12.34 27.13,13.72 26.98,13.72 22.25,18.44 22.25,21.79 IN_JACK.T
INDICATOR1
  Top 0.152: ++1.MP 39.51,21.11 R38.1
MOSFET
  Top 0.152: U$11.P$10 67.02,67.31 53.86,54.14 53.86,45.02 49.99,41.15 49.99,29.3 R45.2
N$1
  Top 0.152: J4.1 3.05,44.04 3.05,78.64 3.96,79.55 U$4.OUT
N$2
  Top 0.152: 6.1,13.41 6.1,15.7 R2.2 | 6.1,13.41 4.72,12.04 C2.+ | R1.2 16.46,18.44 16.46,17.83 13.11,14.48 13.11,13.56 12.34,12.8 11.73,12.8 IC1.3 11.58,12.8 10.97,13.41 6.1,13.41
N$3
  Top 0.152: U$4.MAX 28.5,73.1 U$4.POTMAX
N$4
  Top 0.152: U$4.WIPER 26,73.06 U$4.POTWIPE
N$5
  Top 0.152: U$4.MIN 23.5,73.02 U$4.POTMIN
N$6
  Top 0.152: U$4.INV 4.12,84.58 4.12,82.3 U$4.NONINV 3.02,82.44 1.68,81.1 1.68,42.67 2.91,41.44 R4.1
N$7
  Top 0.152: R23.1 57.15,33.38 57.15,36.12 55.47,37.8 55.47,53.19 58.06,55.78 58.22,55.78 62.13,59.69 U$11.P$13
N$8
  Top 0.152: R24.1 54.86,40.08 54.86,53.76 63.33,62.23 U$11.P$12
N$9
  Top 0.152: 55.23,5.18 R10.2 | 54.41,4.57 54.41,5.03 | 69.02,2.13 R11.2 | 69.04,2.13 R11.2 | 54.41,5.03 55.32,5.03 R10.2 | 58.06,4.12 59.28,2.9 59.74,2.9 IC2.3 | 58.06,4.12 57.15,5.03 55.47,5.03 R10.2 | 54.41,5.03 55.21,5.12 R10.2 | 58.06,4.12 58.67,4.72 61.11,4.72 63.7,2.13 68.87,2.13 R11.2
  Top 0.203: C9.+ 41.57,2.61 42.77,3.8 53.89,3.8 55.21,5.12
N$10
  Top 0.152: C8.+ 7.18,62.18 VOL.P$2
N$11
  Top 0.152: 52.73,89.76 52.73,91.29 U$1.1 52.88,91.44 52.88,98.6 53.19,98.91 58.98,98.91 61.42,96.47 61.42,95.71 60.5,94.79 60.5,93.57 D3.C | D4.C 16.76,93.27 19.36,95.86 21.34,95.86 21.34,95.71 22.86,94.18 27.43,94.18 28.96,92.66 28.96,92.2
  Top 0.203: 52.73,89.76 50.03,87.06 C19.1 44.93,87.2 C18.1 40.18,87.2 38.95,88.43 32.73,88.43 28.96,92.2 | C34.+ 21.38,95.9 21.34,95.86
N$12
  Top 0.152: U1.5 80.77,16.61 80.77,18.14 80.31,18.59 R62.2
N$13
  Top 0.152: 50.75,5.29 R9.1 | 64.62,8.53 65.08,8.99 C13.+ | 47.4,7.32 46.48,8.23 D7.C | 47.4,7.32 49.38,5.33 50.75,5.33 R9.1 | 47.4,7.32 44.96,4.88 C10.+ | 50.9,5.33 R9.1
  Top 0.203: C13.+ 63.34,7.25 59.17,7.25 57.91,8.51 R55.2 57.02,8.51 55.83,9.71 53.83,9.71 52.9,8.78 52.9,7.33 R9.1
N$14
  Top 0.152: 59.77,4.27 IC2.2 59.89,3.96 60.5,3.96 61.27,3.2 61.27,1.22 60.96,0.91 54.56,0.91 53.19,2.29 50.9,2.29 R9.2 50.05,1.68 22.23,1.68 R3.1
N$15
  Top 0.152: R46.1 60.05,24.84 60.05,20.42 R13.2 60.05,20.27 57.3,17.53 57.3,14.94 C11.+
N$16
  Top 0.152: 15.7,10.82 15.85,10.82 17.98,8.69 R3.2 | 15.7,10.82 15.54,10.97 15.54,11.89 16.31,12.65 16.76,12.65 IC1.6 16.92,12.8 16.92,13.87 IC1.7 | 15.7,10.82 10.52,10.82 10.36,10.97 3.81,10.97 3.05,11.73 3.05,15.7 R4.2
N$17
  Top 0.152: IC2.1 59.74,5.49 57.15,5.49 54.41,8.23 54.1,8.23 D7.A
N$18
  Top 0.152: R15.2 46.52,13.56 52.25,13.56 T1.1
N$19
  Top 0.152: R25.1 51.51,47.55 51.51,53.49 69.8,71.78 69.8,72.39 U$11.P$8
N$20
  Top 0.152: R15.1 46.33,16.31 42.67,16.31 42.22,16.76 OK1.1
N$21
  Top 0.152: R13.1 57.26,20.27 55.78,20.27 T1.2
N$31
  Top 0.152: R26.2 38.1,46.94 38.1,45.41 40.39,43.13 LED1.A
N$36
  Top 0.152: R25.2 48.77,47.4 48.77,44.81 50.44,43.13 LED2.A
N$37
  Top 0.152: K2.2 28.65,14.48 33.83,14.48 K2.7
N$38
  Top 0.152: R24.2 51.51,39.47 51.51,37.03 53.06,35.48 54.09,35.43 LED3.A
N$39
  Top 0.152: R23.2 56.52,30.76 LED4.A
N$40
  Top 0.152: J4.2 5.64,44.04 5.64,64.77 6.86,65.99 VOL.P$1
N$41
  Top 0.152: 26.82,96.47 ++.MP
  Top 0.203: R8.1 33.17,90.06 31.15,92.08 31.15,93.2 30.5,93.84 29.39,93.84 ++.MP
N$43
  Top 0.152: C12.2 24.54,8.69 21.49,8.69 R49.1 21.34,8.69 18.75,11.28 16.92,11.28 IC1.5
N$47
  Top 0.152: U$11.P$1 69.88,89.53 69.95,89.46 69.04,88.54 64.77,88.54 61.72,85.5 61.72,85.34 55.02,78.64 48.16,78.64 33.68,64.16 33.68,46.02 33.83,45.87 33.83,45.72 R48.2
N$48
  Top 0.152: R14.2 43.66,37.03 36.88,37.03 35.47,38.44 35.47,64.12 48.66,77.31 56.22,77.31 66.54,87.63 U$11.P$2
N$50  (via drill 0.35)
  Top 0.152: R6.1 40.03,36.27 45.11,36.27 46.33,37.49 46.33,50.75 68.89,73.3 70.41,73.3 v72.69,75.59
  Bottom 0.152: v72.69,75.59 73,75.89 73,78.33 71.32,80.01 U$11.P$5
N$51
  Top 0.152: R5.2 33.98,39.32 33.98,37.49 36.42,35.05 LED5.A
N$52
  Top 0.152: R6.2 32.31,31.24 32.31,30.48 34.59,28.19 LED6.A
N$84
  Top 0.152: R41.2 48.01,24.38 48.01,28.5 R45.1 46.88,28.52 45.14,30.27 Q2.2
OUT
  Top 0.152: 33.98,12.19 K2.6
  Top 0.203: K2.6 36.6,12.29 OK1.3 41.31,10.86 58.24,10.86 68.6,21.22 68.6,35.66 OUT_JACK.T
PHOTO_TRANS
  Top 0.152: 55.61,33.52 55.61,33.53 | 55.61,33.53 55.61,35.98 53.19,38.41 53.19,43.89 54.31,45.02 54.31,53.91 66.4,65.99 71.48,65.99 71.48,68.25 U$11.P$9 | R46.2 60.05,27.74 60.05,30.02 57.91,32.16 56.24,32.16 55.63,32.77 55.63,33.53 55.61,33.53
POT1
  Top 0.152: U$33.P$2 78.64,65.99 78.64,60.05 83.97,54.71 86.11,54.71 U$11.P$35
POT2
  Bottom 0.152: U$11.P$34 84.12,57.15 82.6,58.67 65.08,58.67 62.64,56.24 33.83,56.24 33.83,51.51 30.33,48.01 29.57,48.01 U$34.P$2
POT3
  Bottom 0.152: U$35.P$2 63.09,77.41 63.09,77.11 68.73,71.48 71.78,71.48 72.83,70.43 72.83,65.81 78.89,59.74 85.07,59.74 U$11.P$33
POT4
  Top 0.152: U$11.P$32 86.11,62.33 86.11,60.66 86.72,60.05 86.72,54.25 86.11,53.65 80.01,53.65 79.55,53.19 76.66,53.19 76.5,53.34 69.19,53.34 68.28,54.25 60.5,54.25 57.76,51.51 57.76,49.53 58.98,48.31 58.98,48.01 U$36.P$2
POT5
  Top 0.152: U$11.P$31 84.58,64.77 77.88,71.48 77.72,71.48 75.89,73.3 75.89,73.76 73.46,76.2 63.25,76.2 50.9,63.86 49.38,63.86 44.65,59.13 44.35,59.13 U$37.P$2
Q_1
  Top 0.152: 60.5,39.62 59.13,39.62 J1.2 60.5,39.62 | 60.5,39.62 60.5,41.15 66.9,47.55 66.9,48.46 69.8,51.36 69.8,51.97 U$11.P$16
Q_2
  Top 0.152: U$11.P$17 69.34,49.53 61.11,41.3 61.11,39.01 59.13,37.03 J1.1
RX  (via drill 0.35)
  Top 0.152: R5.1 36.88,39.48 36.88,56.39 44.65,64.16 50.75,64.16 63.4,76.81 69.22,76.81 U$11.P$6 69.95,77.42 70.87,76.5 75.29,76.5 78.33,73.46 78.33,72.08 84.12,66.29 85.65,66.29 86.72,65.23 86.72,64.31 86.26,63.86 84.73,63.86 82.3,61.42 v82.3,57.3
  Bottom 0.152: v82.3,57.3 79.55,54.56 78.18,54.56 J3.2
SCL_3.3V  (via drill 0.35)
  Top 0.152: U1.2 80.92,15.09 83.21,15.09 83.36,15.24 | R61.2 84.58,16.44 84.58,20.46 | v84.67,39.32 84.58,39.22 84.58,20.46 | 84.58,20.46
  Top 0.203: R61.2 83.38,15.24 83.36,15.24
  Bottom 0.152: v84.67,39.32 75.44,48.55 75.44,51.82 70.56,56.69 70.41,56.69 69.95,57.15 U$11.P$14
SDA_3.3V  (via drill 0.35)
  Top 0.152: R60.2 83.36,18.29 83.36,17.37 81.84,15.85 81.84,15.7 81.69,15.54 80.92,15.54 U1.3 80.81,15.54 80.01,15.54 | v72.08,52.73 74.52,52.73 76.66,50.6 79.55,50.6 82.57,47.58 82.57,22.83 80.01,20.27 78.64,20.27
  Top 0.203: 78.64,20.27 78.54,20.17 78.54,17.06 79.66,15.93 79.66,15.89 80.01,15.54
  Bottom 0.152: 70.71,54.56 69.95,54.56 U$11.P$15 70.71,54.56 | 70.71,54.56 70.71,54.1 v72.08,52.73
STM_READ_AUDIO
  Top 0.152: 86.85,7.79 87.37,8.31 87.37,35.77 87.25,35.88 87.25,49.94 U$11.P$36 | 77.57,4.42 J6.1 77.68,4.37 77.72,4.42 80.31,4.42 83.67,7.77 | 66.29,10.97 65.28,10.97 C13.-
  Top 0.203: 77.68,4.37 75.2,1.9 R12.1 71.2,3.92 71.2,6.07 66.29,10.97 | 83.67,7.77 86.83,7.77 86.85,7.79
TX  (via drill 0.35)
  Top 0.152: U$11.P$7 68.05,74.93 40.8,47.68 R26.1 | v72.24,77.11 75.13,77.11 83.36,68.89 85.5,68.89 87.02,67.36 87.02,54.1 86.26,53.34 84.43,53.34 83.06,51.97 78.18,51.97 J3.3
  Bottom 0.152: v72.24,77.11 71.17,76.05 71.17,75.89 70.26,74.98 69.95,74.98 U$11.P$7
VB  (via drill 0.35)
  Top 0.152: IC1.2 11.73,14.02 11.73,15.09 IC1.1 11.58,15.24 8.99,15.24 7.32,16.92 4.88,16.92 | 11.43,5.33 12.5,4.27 C4.+ | 12.34,7.01 12.34,6.25 11.43,5.33 | 12.34,7.01 12.34,8.53 C6.1 | 12.34,7.01 19.05,7.01 20.12,5.94 21.34,5.94 R49.2 | 4.88,16.92 1.98,16.92 1.68,16.61 1.68,11.58 7.77,5.49 8.84,5.49 C5.1 9.02,5.33 11.43,5.33 | v6.1,37.95 6.1,20.73 4.88,19.51 4.88,16.92 | 10.67,44.05 J4.4 | 45.72,80.47 38.86,80.47 24.54,66.14 13.56,66.14 VOL.P$3 10.67,63.17 10.67,51.05
  Top 0.203: 10.67,51.05 10.67,44.05 | 45.72,80.47 47.7,82.44 U$4.VB
  Bottom 0.152: v6.1,37.95 6.1,38.25 10.52,42.67 10.52,43.89 J4.4 | 53.49,82.3 U$4.VB

### Text on the board
tPlace: JILL | V3.6 | JILL